# EAGLE schematic Roland+mem2 (EAGLE 6.6.0)

## Sheet 1 of 4
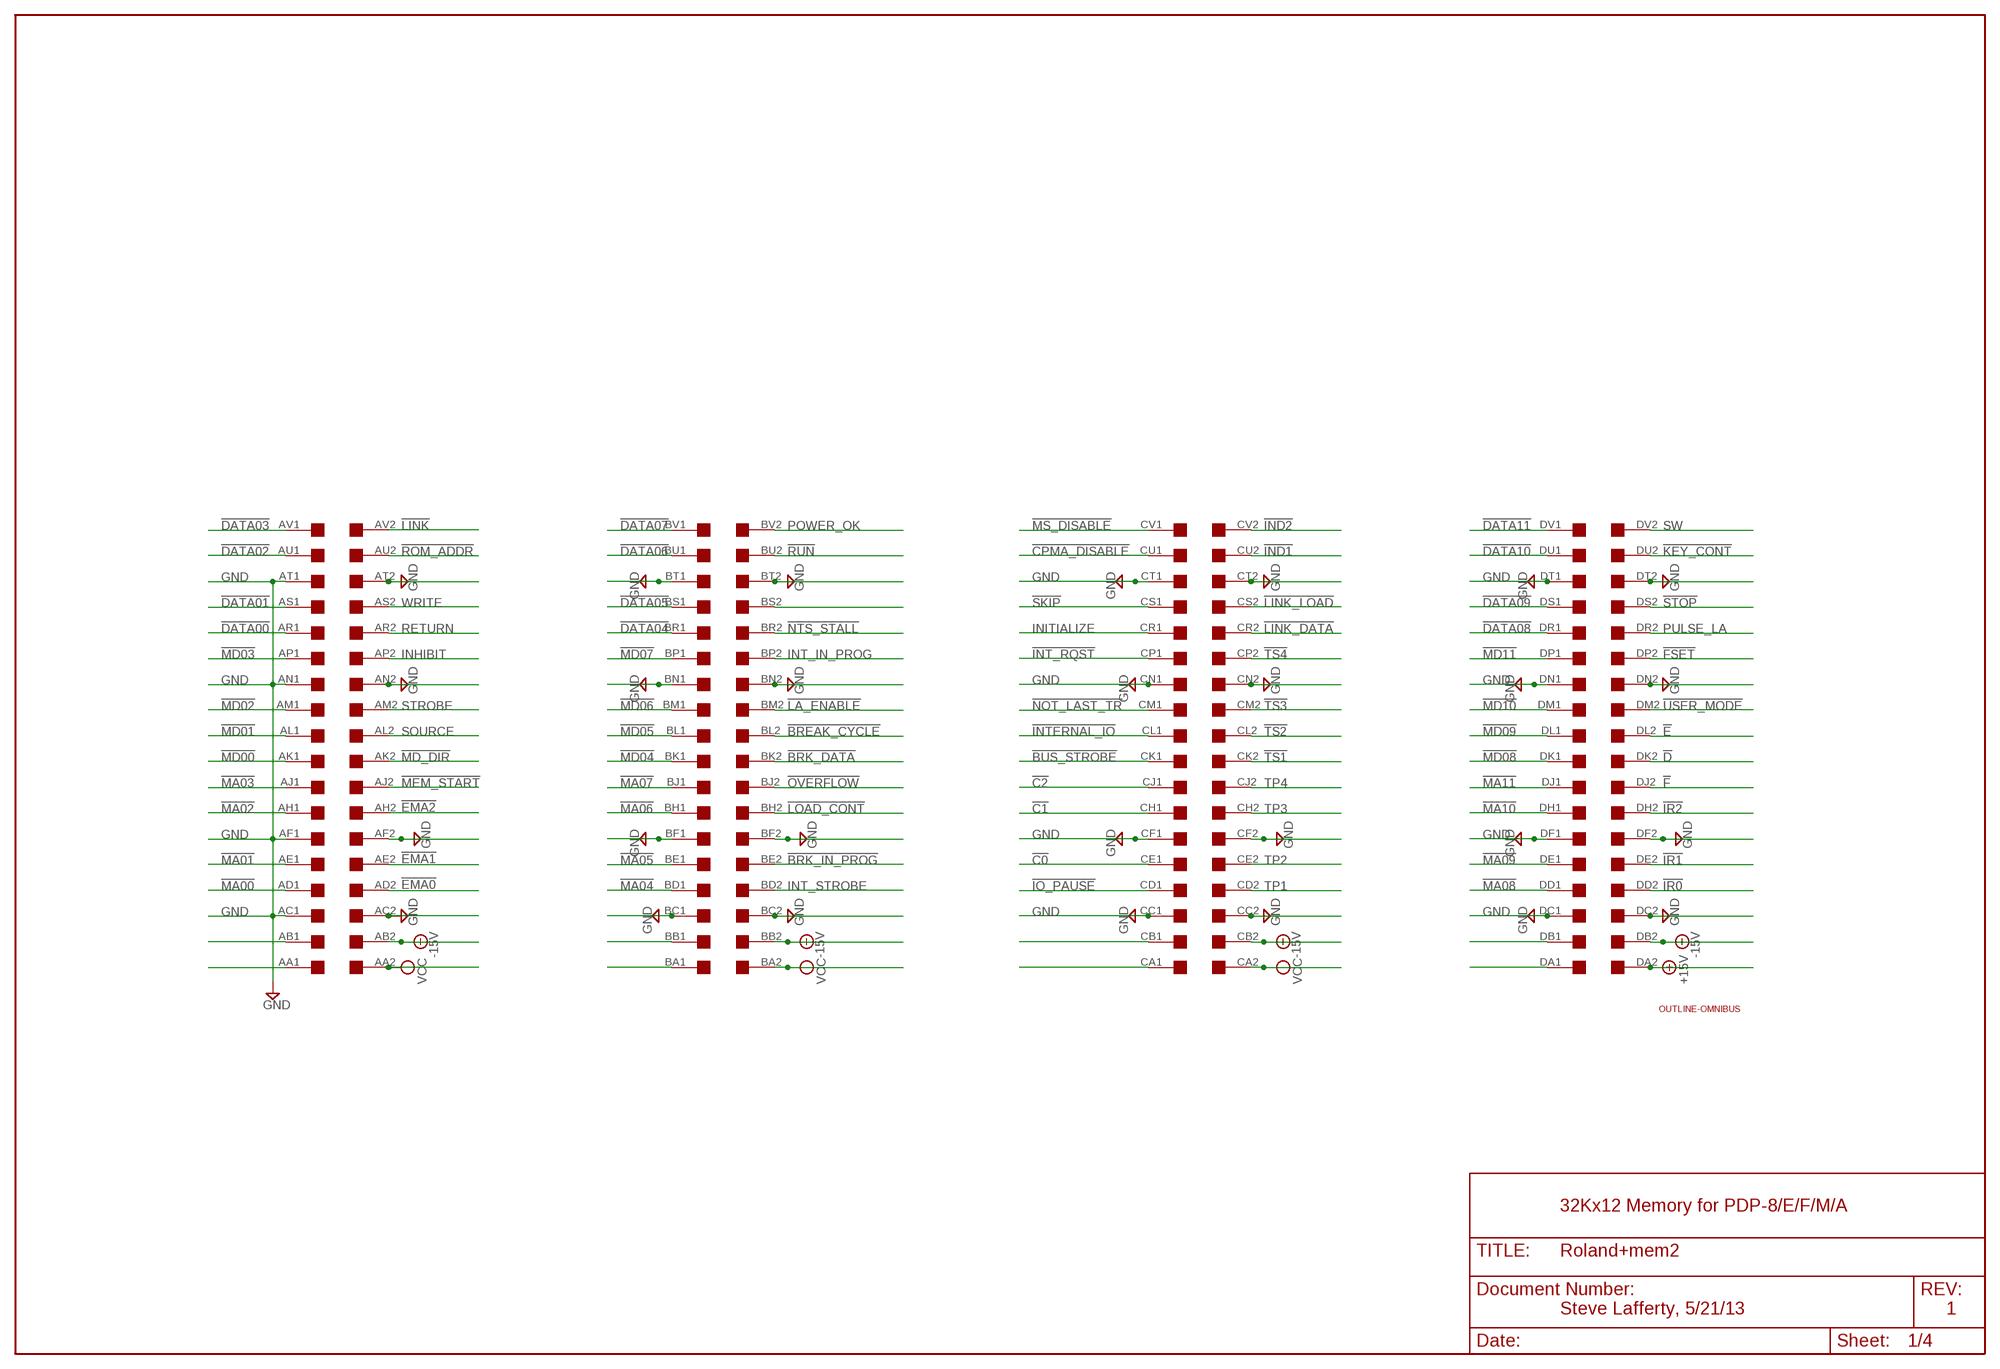
[diagram p0: schematic, sheet 1]

### Parts
J1  EDGE  QUAD  [EDGE-CON8]
U$1  OUTLINE-OMNIBUS  [OMNIBUS]

### Nets
!BREAK_CYCLE: J1.BL2
!BRK_DATA: J1.BK2 ; also sheet 2
!BRK_IN_PROG: J1.BE2
!BUS_STROBE: J1.CK1
!C0: J1.CE1
!C1: J1.CH1
!C2: J1.CJ1
!CPMA_DISABLE: J1.CU1
!D: J1.DK2
!DATA00: J1.AR1 ; also sheet 2
!DATA01: J1.AS1 ; also sheet 2
!DATA02: J1.AU1 ; also sheet 2
!DATA03: J1.AV1 ; also sheet 2
!DATA04: J1.BR1 ; also sheet 2
!DATA05: J1.BS1 ; also sheet 2
!DATA06: J1.BU1 ; also sheet 2
!DATA07: J1.BV1 ; also sheet 2
!DATA08: J1.DR1 ; also sheet 2
!DATA09: J1.DS1 ; also sheet 2
!DATA10: J1.DU1 ; also sheet 2
!DATA11: J1.DV1 ; also sheet 2
!E: J1.DL2
!EMA0: J1.AD2 ; also sheet 3
!EMA1: J1.AE2 ; also sheet 3
!EMA2: J1.AH2 ; also sheet 3
!F: J1.DJ2
!FSET: J1.DP2
!IND1: J1.CU2
!IND2: J1.CV2
!INT_RQST: J1.CP1
!INTERNAL_IO: J1.CL1
!IO_PAUSE: J1.CD1
!IR0: J1.DD2
!IR1: J1.DE2
!IR2: J1.DH2
!KEY_CONT: J1.DU2 ; also sheet 2
!LA_ENABLE: J1.BM2 ; also sheet 2
!LINK: J1.AV2
!LINK_DATA: J1.CR2
!LINK_LOAD: J1.CS2
!LOAD_CONT: J1.BH2
!MA00: J1.AD1 ; also sheet 3
!MA01: J1.AE1 ; also sheet 3
!MA02: J1.AH1 ; also sheet 3
!MA03: J1.AJ1 ; also sheet 3
!MA04: J1.BD1 ; also sheet 3
!MA05: J1.BE1 ; also sheet 3
!MA06: J1.BH1 ; also sheet 3
!MA07: J1.BJ1 ; also sheet 3
!MA08: J1.DD1 ; also sheet 3
!MA09: J1.DE1 ; also sheet 3
!MA10: J1.DH1 ; also sheet 3
!MA11: J1.DJ1 ; also sheet 3
!MD00: J1.AK1 ; also sheet 3
!MD01: J1.AL1 ; also sheet 3
!MD02: J1.AM1 ; also sheet 3
!MD03: J1.AP1 ; also sheet 3
!MD04: J1.BK1 ; also sheet 3
!MD05: J1.BL1 ; also sheet 3
!MD06: J1.BM1 ; also sheet 3
!MD07: J1.BP1 ; also sheet 3
!MD08: J1.DK1 ; also sheet 3
!MD09: J1.DL1 ; also sheet 3
!MD10: J1.DM1 ; also sheet 3
!MD11: J1.DP1 ; also sheet 3
!MD_DIR: J1.AK2 ; also sheet 2,3
!MEM_START: J1.AJ2 ; also sheet 2
!MS_DISABLE: J1.CV1 ; also sheet 2
!NOT_LAST_TR: J1.CM1
!NTS_STALL: J1.BR2
!OVERFLOW: J1.BJ2
!ROM_ADDR: J1.AU2 ; also sheet 3
!RUN: J1.BU2 ; also sheet 2
!SKIP: J1.CS1
!STOP: J1.DS2 ; also sheet 2
!TS1: J1.CK2
!TS2: J1.CL2
!TS3: J1.CM2
!TS4: J1.CP2 ; also sheet 2
!USER_MODE: J1.DM2
+15V: J1.DA2
-15V [supply]: J1.AB2 J1.BB2 J1.CB2 J1.DB2
GND [supply]: J1.AC1 J1.AC2 J1.AF1 J1.AF2 J1.AN1 J1.AN2 J1.AT1 J1.AT2 J1.BC1 J1.BC2 J1.BF1 J1.BF2 J1.BN1 J1.BN2 J1.BT1 J1.BT2 J1.CC1 J1.CC2 J1.CF1 J1.CF2 J1.CN1 J1.CN2 J1.CT1 J1.CT2 J1.DC1 J1.DC2 J1.DF1 J1.DF2 J1.DN1 J1.DN2 J1.DT1 J1.DT2 ; also sheet 2,3,4
INHIBIT: J1.AP2
INITIALIZE: J1.CR1 ; also sheet 2
INT_IN_PROG: J1.BP2
INT_STROBE: J1.BD2
N$46: J1.AB1
N$47: J1.AA1
N$48: J1.BB1
N$49: J1.BA1
N$50: J1.CA1
N$51: J1.BS2
N$52: J1.CB1
N$53: J1.DA1
N$54: J1.DB1
POWER_OK: J1.BV2 ; also sheet 3
PULSE_LA: J1.DR2 ; also sheet 2
RETURN: J1.AR2
SOURCE: J1.AL2 ; also sheet 3
STROBE: J1.AM2
SW: J1.DV2 ; also sheet 2
TP1: J1.CD2
TP2: J1.CE2
TP3: J1.CH2
TP4: J1.CJ2 ; also sheet 2
VCC [supply]: J1.AA2 J1.BA2 J1.CA2 ; also sheet 2,3
WRITE: J1.AS2 ; also sheet 3

### Notes on the sheet
- 32Kx12 Memory for PDP-8/E/F/M/A
- Steve Lafferty, 5/21/13 | 1

## Sheet 2 of 4
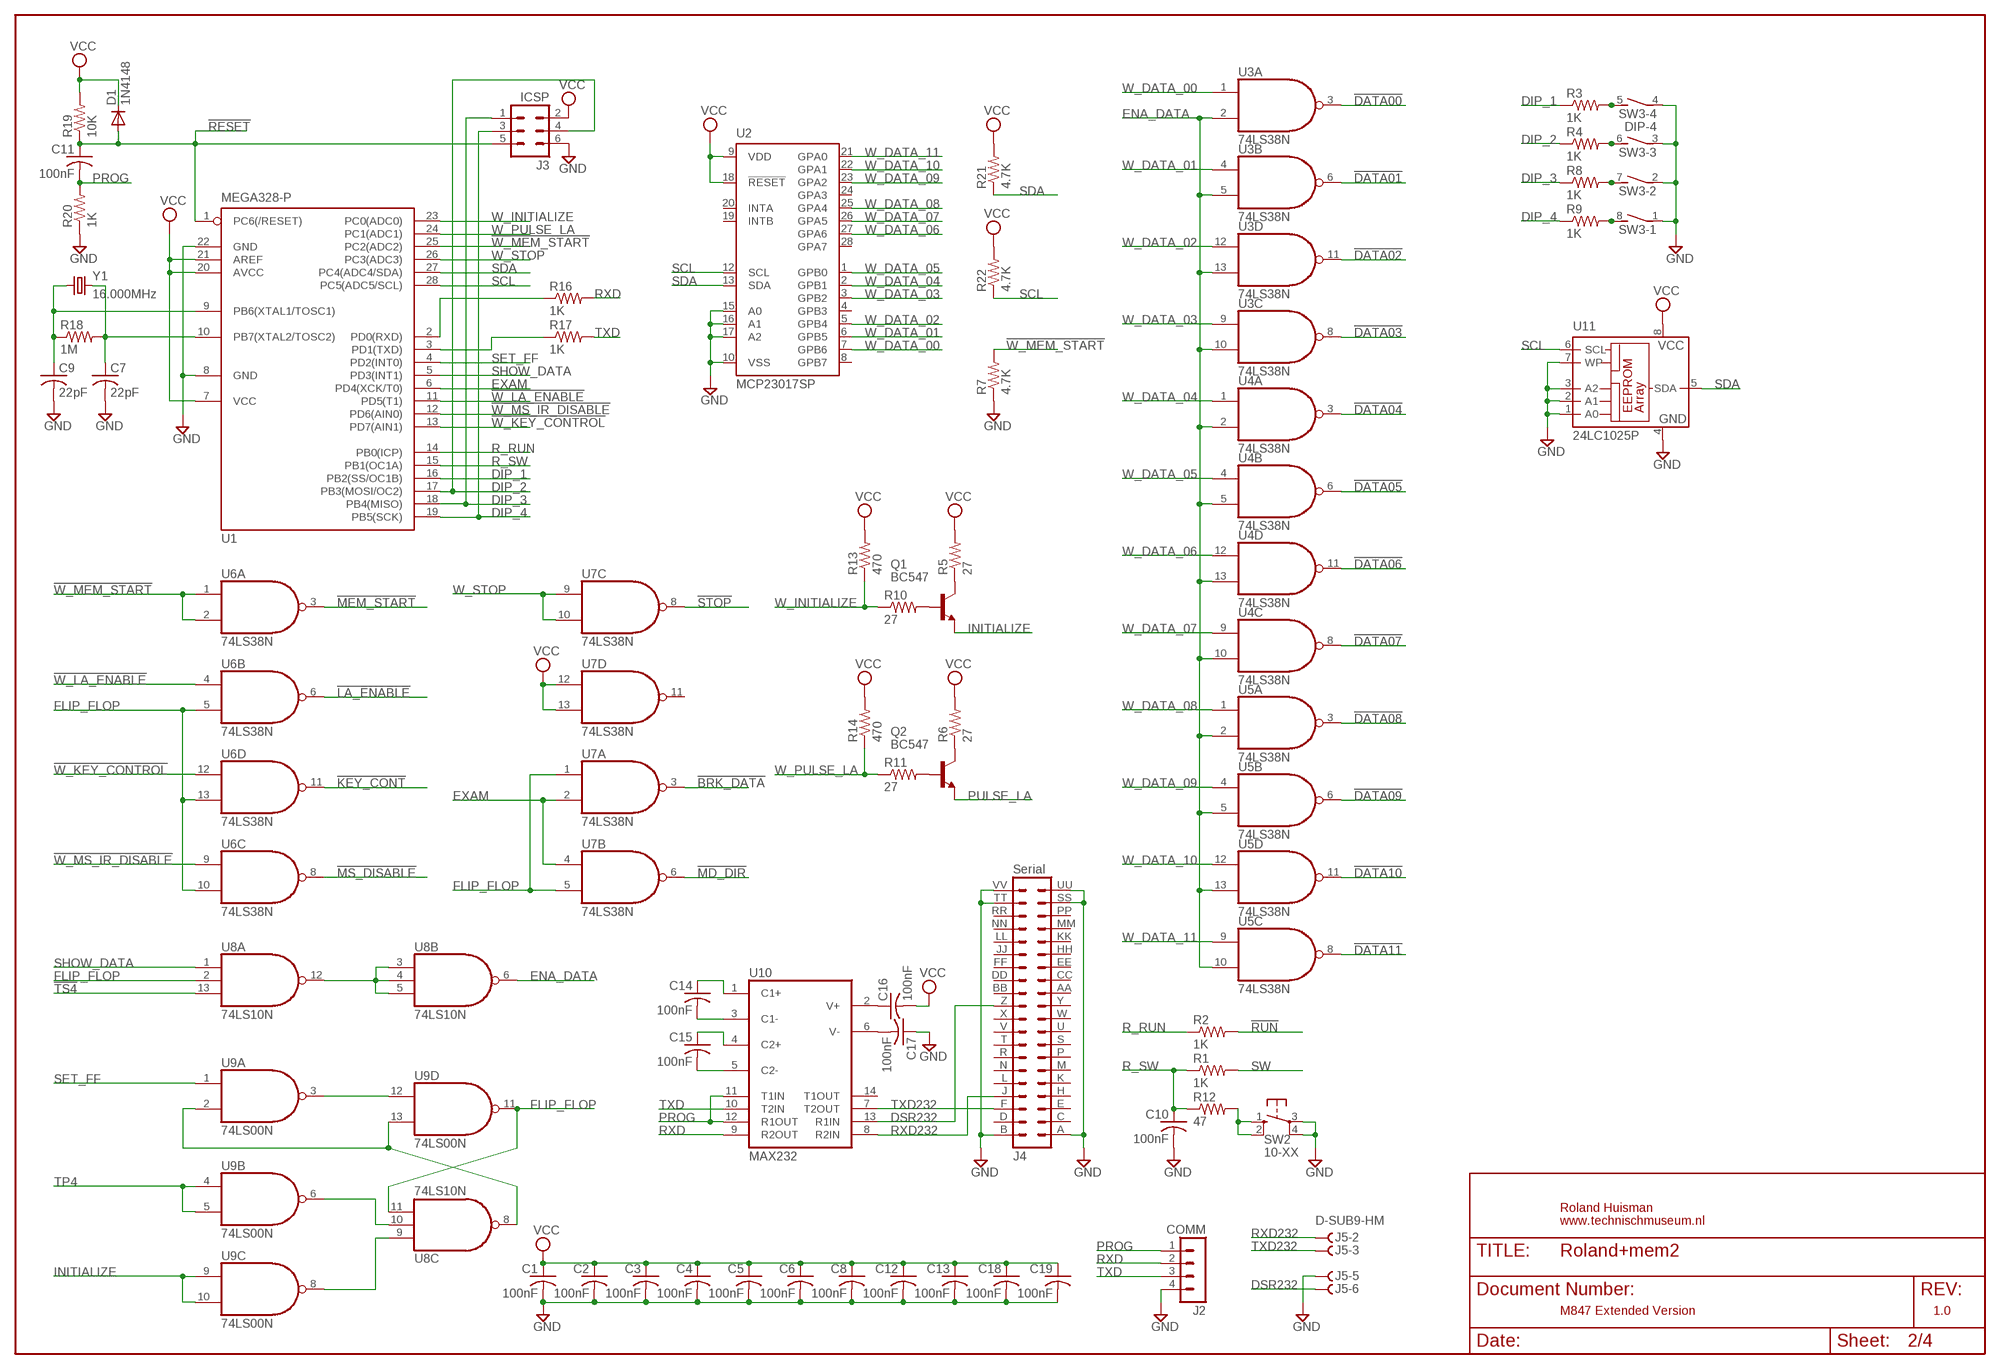
[diagram p1: schematic, sheet 2]

### Parts
C1  100nF  C-US050-025X075  [C050-025X075]
C2  100nF  C-US050-025X075  [C050-025X075]
C3  100nF  C-US050-025X075  [C050-025X075]
C4  100nF  C-US050-025X075  [C050-025X075]
C5  100nF  C-US050-025X075  [C050-025X075]
C6  100nF  C-US050-025X075  [C050-025X075]
C7  22pF  C-US050-025X075  [C050-025X075]
C8  100nF  C-US050-025X075  [C050-025X075]
C9  22pF  C-US050-025X075  [C050-025X075]
C10  100nF  C-US050-025X075  [C050-025X075]
C11  100nF  C-US050-025X075  [C050-025X075]
C12  100nF  C-US050-025X075  [C050-025X075]
C13  100nF  C-US050-025X075  [C050-025X075]
C14  100nF  C-US050-025X075  [C050-025X075]
C15  100nF  C-US050-025X075  [C050-025X075]
C16  100nF  C-US050-025X075  [C050-025X075]
C17  100nF  C-US050-025X075  [C050-025X075]
C18  100nF  C-US050-025X075  [C050-025X075]
C19  100nF  C-US050-025X075  [C050-025X075]
D1  1N4148  1N4148DO35-10  [DO35-10]
J2  COMM  MA04-1  [MA04-1]
J3  ICSP  MA03-2  [MA03-2]
J4  Serial  DEC40PINH  [DEC40PINH]
J5  D-SUB9-HM  D-SUB9-H5M09RA  [H5M09RA]
Q1  BC547  -NPN-TO5  [TO5]
Q2  BC547  -NPN-TO5  [TO5]
R1  1K  R-US_0207/10  [0207/10]
R2  1K  R-US_0207/10  [0207/10]
R3  1K  R-US_0207/10  [0207/10]
R4  1K  R-US_0207/10  [0207/10]
R5  27  R-US_0207/10  [0207/10]
R6  27  R-US_0207/10  [0207/10]
R7  4.7K  R-US_0207/10  [0207/10]
R8  1K  R-US_0207/10  [0207/10]
R9  1K  R-US_0207/10  [0207/10]
R10  27  R-US_0207/10  [0207/10]
R11  27  R-US_0207/10  [0207/10]
R12  47  R-US_0207/10  [0207/10]
R13  470  R-US_0207/10  [0207/10]
R14  470  R-US_0207/10  [0207/10]
R16  1K  R-US_0207/10  [0207/10]
R17  1K  R-US_0207/10  [0207/10]
R18  1M  R-US_0207/10  [0207/10]
R19  10K  R-US_0207/10  [0207/10]
R20  1K  R-US_0207/10  [0207/10]
R21  4.7K  R-US_0207/10  [0207/10]
R22  4.7K  R-US_0207/10  [0207/10]
SW2  10-XX  [B3F-10XX]
SW3  DIP-4  DIP04S  [DIP04S]
U1  MEGA328-P  MEGA8-P  [DIL28-3]
U2  MCP23017SP  [DIL28-3]
U3  74LS38N  [DIL14]
U4  74LS38N  [DIL14]
U5  74LS38N  [DIL14]
U6  74LS38N  [DIL14]
U7  74LS38N  [DIL14]
U8  74LS10N  [DIL14]
U9  74LS00N  [DIL14]
U10  MAX232  [DIL16]
U11  24LC1025P  24LC025P  [DIL8]
Y1  16.000MHz  CRYSTALHC49U-H  [HC49U-H]

### Nets
!BRK_DATA: U7.3(A:O) ; also sheet 1
!DATA00: U3.3(A:O) ; also sheet 1
!DATA01: U3.6(B:O) ; also sheet 1
!DATA02: U3.11(D:O) ; also sheet 1
!DATA03: U3.8(C:O) ; also sheet 1
!DATA04: U4.3(A:O) ; also sheet 1
!DATA05: U4.6(B:O) ; also sheet 1
!DATA06: U4.11(D:O) ; also sheet 1
!DATA07: U4.8(C:O) ; also sheet 1
!DATA08: U5.3(A:O) ; also sheet 1
!DATA09: U5.6(B:O) ; also sheet 1
!DATA10: U5.11(D:O) ; also sheet 1
!DATA11: U5.8(C:O) ; also sheet 1
!KEY_CONT: U6.11(D:O) ; also sheet 1
!LA_ENABLE: U6.6(B:O) ; also sheet 1
!MD_DIR: U7.6(B:O) ; also sheet 1,3
!MEM_START: U6.3(A:O) ; also sheet 1
!MS_DISABLE: U6.8(C:O) ; also sheet 1
!RESET: C11.1 D1.A J3.5 R19.1 U1.1(PC6(/RESET))
!RUN: R2.2 ; also sheet 1
!STOP: U7.8(C:O) ; also sheet 1
!TS4: U8.13(A:I2) ; also sheet 1
!W_KEY_CONTROL: U1.13(PD7(AIN1)) U6.12(D:I0)
!W_LA_ENABLE: U1.11(PD5(T1)) U6.4(B:I0)
!W_MEM_START: R7.2 U1.25(PC2(ADC2)) U6.1(A:I0) U6.2(A:I1)
!W_MS_IR_DISABLE: U1.12(PD6(AIN0)) U6.9(C:I0)
DIP_1: R3.1 U1.16(PB2(SS/OC1B))
DIP_2: J3.4 R4.1 U1.17(PB3(MOSI/OC2))
DIP_3: J3.1 R8.1 U1.18(PB4(MISO))
DIP_4: J3.3 R9.1 U1.19(PB5(SCK))
DSR232: J4.Z J5.6 U10.13(R1IN)
ENA_DATA: U3.2(A:I1) U3.5(B:I1) U3.10(C:I1) U3.13(D:I1) U4.2(A:I1) U4.5(B:I1) U4.10(C:I1) U4.13(D:I1) U5.2(A:I1) U5.5(B:I1) U5.10(C:I1) U5.13(D:I1) U8.6(B:O)
EXAM: U1.6(PD4(XCK/T0)) U7.2(A:I1) U7.4(B:I0)
FLIP_FLOP: U6.5(B:I1) U6.10(C:I1) U6.13(D:I1) U7.1(A:I0) U7.5(B:I1) U8.2(A:I1) U8.11(C:I2) U9.11(D:O)
GND [supply]: C1.2 C2.2 C3.2 C4.2 C5.2 C6.2 C7.2 C8.2 C9.2 C10.2 C12.2 C13.2 C17.1 C18.2 C19.2 J2.4 J3.6 J4.A J4.B J4.SS J4.TT J4.UU J4.VV J5.5 R7.1 R20.1 SW2.3(P) SW2.4(P1) SW3.1 SW3.2 SW3.3 SW3.4 U1.8(GND) U1.22(GND) U2.10(VSS) U2.15(A0) U2.16(A1) U2.17(A2) U11.1(A0) U11.2(A1) U11.3(A2) U11.4(GND) U11.7(WP) ; also sheet 1,3,4
INITIALIZE: Q1.1(E) U9.9(C:I0) U9.10(C:I1) ; also sheet 1
N$1: C7.1 R18.2 U1.10(PB7(XTAL2/TOSC2)) Y1.1
N$2: C9.1 R18.1 U1.9(PB6(XTAL1/TOSC1)) Y1.2
N$4: Q1.3(C) R5.1
N$5: Q1.2(B) R10.2
N$6: Q2.3(C) R6.1
N$7: Q2.2(B) R11.2
N$8: U9.3(A:O) U9.12(D:I0)
N$9: U8.3(B:I0) U8.4(B:I1) U8.5(B:I2) U8.12(A:O)
N$10: U8.8(C:O) U9.2(A:I1) U9.13(D:I1)
N$12: R17.1 U1.3(PD1(TXD))
N$13: R16.1 U1.2(PD0(RXD))
N$14: U8.10(C:I1) U9.6(B:O)
N$15: U8.9(C:I0) U9.8(C:O)
N$16: C17.2 U10.6(V-)
N$17: C14.1 U10.1(C1+)
N$827: C14.2 U10.3(C1-)
N$914: C15.2 U10.5(C2-)
N$915: C15.1 U10.4(C2+)
N$916: C16.1 U10.2(V+)
N$918: R12.2 SW2.1(S) SW2.2(S1)
N$919: R3.2 SW3.5
N$920: R4.2 SW3.6
N$921: R8.2 SW3.7
N$922: R9.2 SW3.8
PROG: C11.2 J2.1 R20.2 U10.11(T1IN) U10.12(R1OUT)
PULSE_LA: Q2.1(E) ; also sheet 1
R_RUN: R2.1 U1.14(PB0(ICP))
R_SW: C10.1 R1.1 R12.1 U1.15(PB1(OC1A))
RXD: J2.2 R16.2 U10.9(R2OUT)
RXD232: J4.J J5.2 U10.8(R2IN)
SCL: R22.1 U1.28(PC5(ADC5/SCL)) U2.12(SCL) U11.6(SCL)
SDA: R21.1 U1.27(PC4(ADC4/SDA)) U2.13(SDA) U11.5(SDA)
SET_FF: U1.4(PD2(INT0)) U9.1(A:I0)
SHOW_DATA: U1.5(PD3(INT1)) U8.1(A:I0)
SW: R1.2 ; also sheet 1
TP4: U9.4(B:I0) U9.5(B:I1) ; also sheet 1
TXD: J2.3 R17.2 U10.10(T2IN)
TXD232: J4.F J5.3 U10.7(T2OUT)
VCC [supply]: C1.1 C2.1 C3.1 C4.1 C5.1 C6.1 C8.1 C12.1 C13.1 C16.2 C18.1 C19.1 D1.C J3.2 R5.2 R6.2 R13.2 R14.2 R19.2 R21.2 R22.2 U1.7(VCC) U1.20(AVCC) U1.21(AREF) U2.9(VDD) U2.18(!RESET) U7.12(D:I0) U7.13(D:I1) U11.8(VCC) ; also sheet 1,3
W_DATA_00: U2.7(GPB6) U3.1(A:I0)
W_DATA_01: U2.6(GPB5) U3.4(B:I0)
W_DATA_02: U2.5(GPB4) U3.12(D:I0)
W_DATA_03: U2.3(GPB2) U3.9(C:I0)
W_DATA_04: U2.2(GPB1) U4.1(A:I0)
W_DATA_05: U2.1(GPB0) U4.4(B:I0)
W_DATA_06: U2.27(GPA6) U4.12(D:I0)
W_DATA_07: U2.26(GPA5) U4.9(C:I0)
W_DATA_08: U2.25(GPA4) U5.1(A:I0)
W_DATA_09: U2.23(GPA2) U5.4(B:I0)
W_DATA_10: U2.22(GPA1) U5.12(D:I0)
W_DATA_11: U2.21(GPA0) U5.9(C:I0)
W_INITIALIZE: R10.1 R13.1 U1.23(PC0(ADC0))
W_PULSE_LA: R11.1 R14.1 U1.24(PC1(ADC1))
W_STOP: U1.26(PC3(ADC3)) U7.9(C:I0) U7.10(C:I1)
Unconnected: J4.AA J4.BB J4.C J4.CC J4.D J4.DD J4.E J4.EE J4.FF J4.H J4.HH J4.JJ J4.K J4.KK J4.L J4.LL J4.M J4.MM J4.N J4.NN J4.P J4.PP J4.R J4.RR J4.S J4.T J4.U J4.V J4.W J4.X J4.Y J5.1 J5.4 J5.7 J5.8 J5.9 U2.4(GPB3) U2.8(GPB7) U2.19(INTB) U2.20(INTA) U2.24(GPA3) U2.28(GPA7) U7.11(D:O) U10.14(T1OUT)

### Notes on the sheet
- Roland Huisman
- D-SUB9-HM | www.technischmuseum.nl
- M847 Extended Version | 1.0

## Sheet 3 of 4
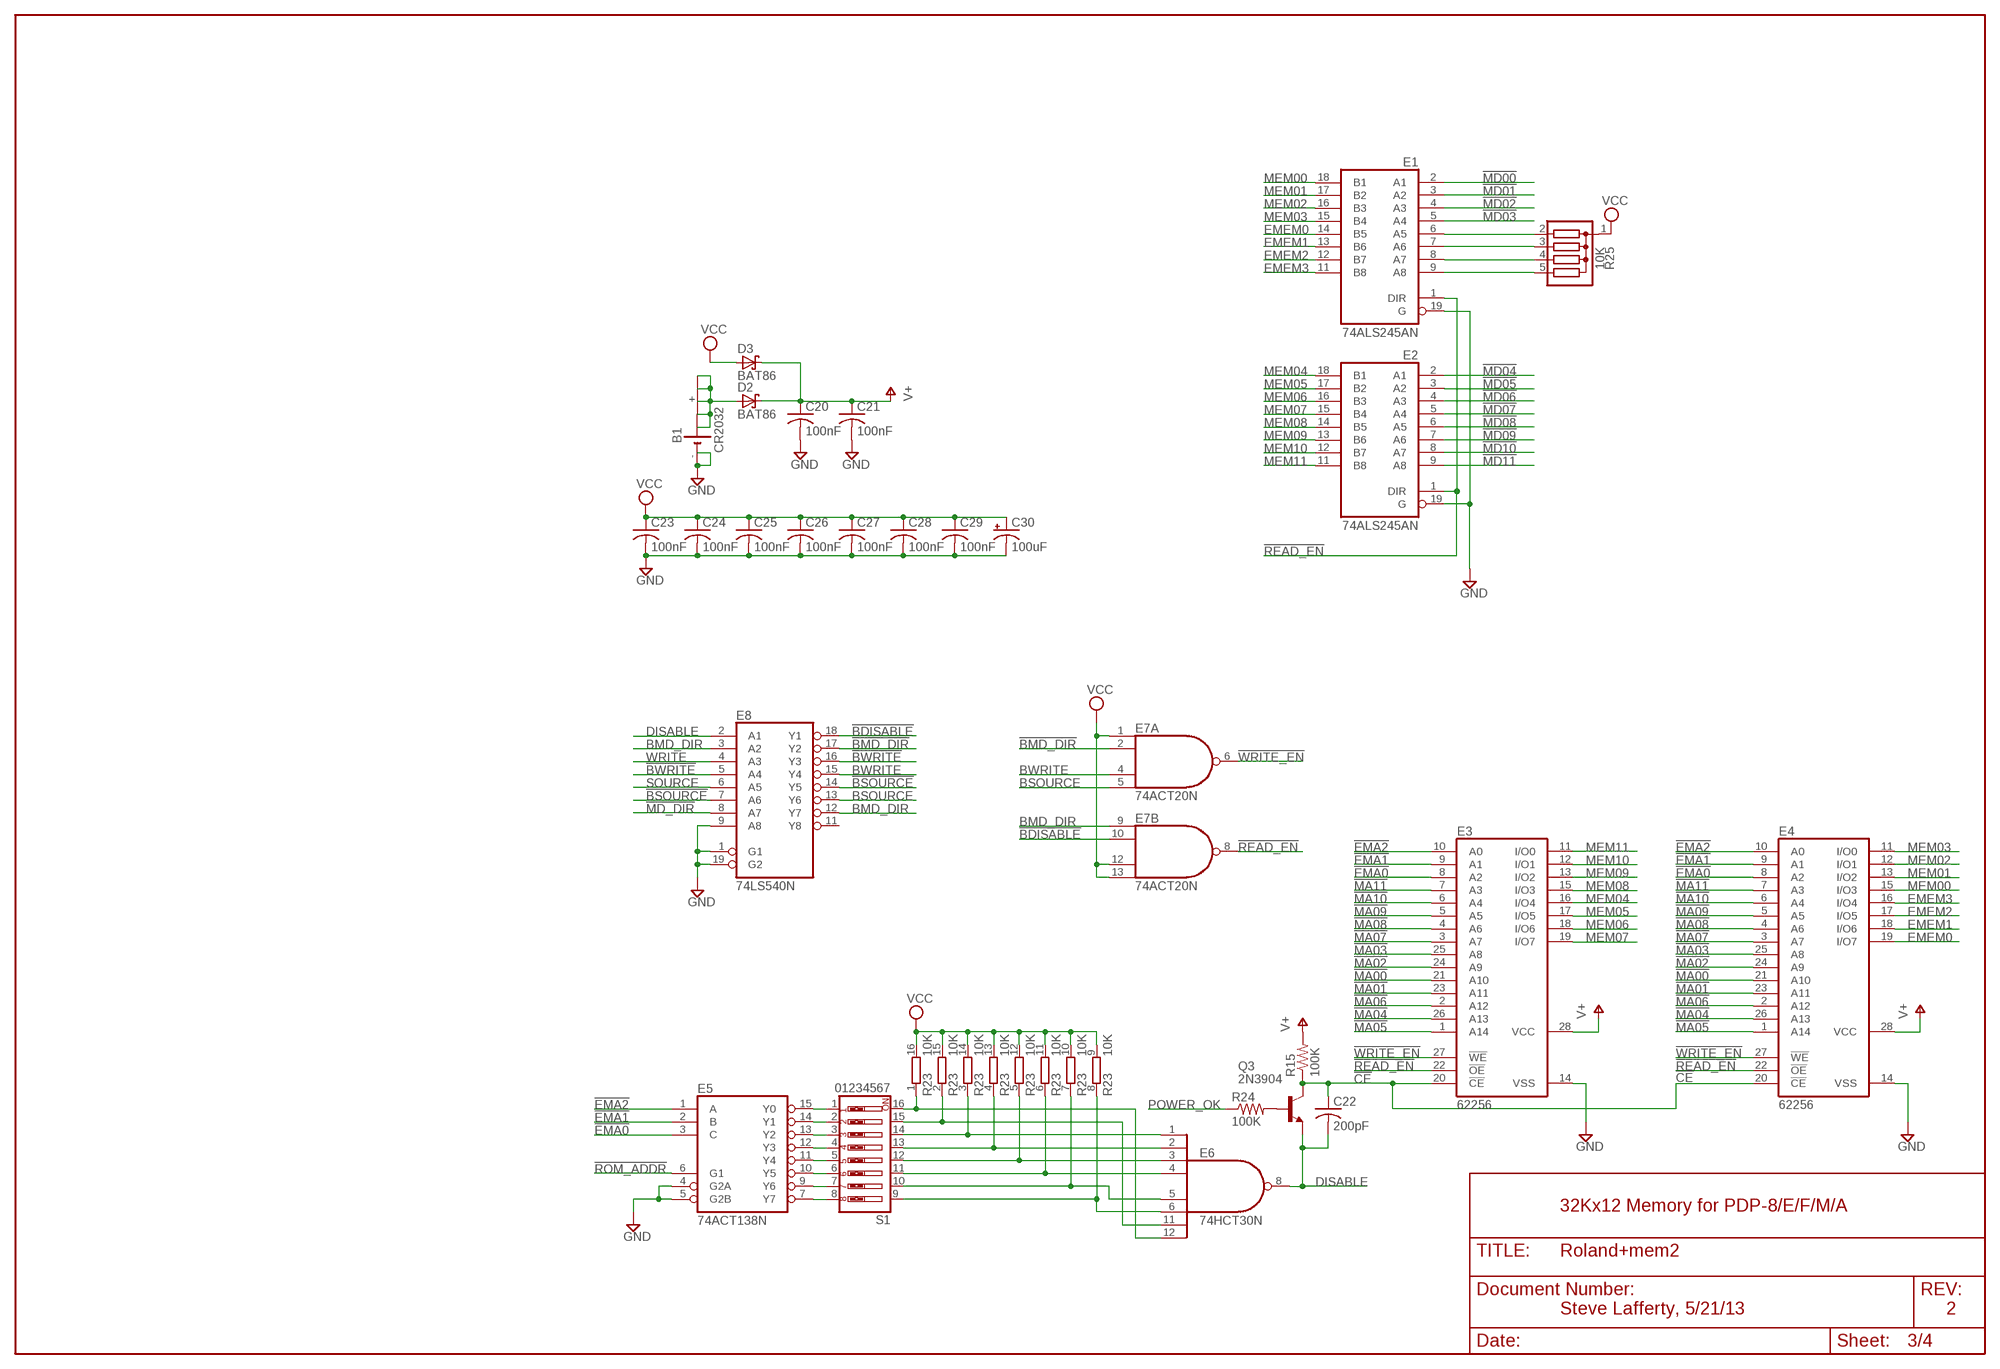
[diagram p2: schematic, sheet 3]

### Parts
B1  CR2032  B2430UNI  [B2430UNI]
C20  100nF  C-US050-025X075  [C050-025X075]
C21  100nF  C-US050-025X075  [C050-025X075]
C22  200pF  C-US050-025X075  [C050-025X075]
C23  100nF  C-US050-025X075  [C050-025X075]
C24  100nF  C-US050-025X075  [C050-025X075]
C25  100nF  C-US050-025X075  [C050-025X075]
C26  100nF  C-US050-025X075  [C050-025X075]
C27  100nF  C-US050-025X075  [C050-025X075]
C28  100nF  C-US050-025X075  [C050-025X075]
C29  100nF  C-US050-025X075  [C050-025X075]
C30  100uF  CPOL-USE20-8AXIAL  [E12-8]
D2  BAT86  BAT19  [DO35-10]
D3  BAT86  BAT19  [DO35-10]
E1  74ALS245AN  74LS245N  [DIL20]
E2  74ALS245AN  74LS245N  [DIL20]
E3  62256  58C256P  [DIL28-6]
E4  62256  58C256P  [DIL28-6]
E5  74ACT138N  74LS138N  [DIL16]
E6  74HCT30N  74LS30N  [DIL14]
E7  74ACT20N  74LS20N  [DIL14]
E8  74LS540N  [DIL20]
Q3  2N3904  [TO92]
R15  100K  R-US_0207/10  [0207/10]
R23  10K  8R-P  [DIL16]
R24  100K  R-US_0207/10  [0207/10]
R25  10K  G04R  [SIL5]
S1  01234567  SW_DIP-8  [EDG-08]

### Nets
!BDISABLE: E7.10(B:I1) E8.18(Y1)
!BMD_DIR: E7.2(A:I1) E8.17(Y2)
!BSOURCE: E8.7(A6) E8.14(Y5)
!BWRITE: E8.5(A4) E8.16(Y3)
!CE: C22.1 E3.20(!CE) E4.20(!CE) Q3.1(C) R15.1
!EMA0: E3.8(A2) E4.8(A2) E5.3(C) ; also sheet 1
!EMA1: E3.9(A1) E4.9(A1) E5.2(B) ; also sheet 1
!EMA2: E3.10(A0) E4.10(A0) E5.1(A) ; also sheet 1
!MA00: E3.21(A10) E4.21(A10) ; also sheet 1
!MA01: E3.23(A11) E4.23(A11) ; also sheet 1
!MA02: E3.24(A9) E4.24(A9) ; also sheet 1
!MA03: E3.25(A8) E4.25(A8) ; also sheet 1
!MA04: E3.26(A13) E4.26(A13) ; also sheet 1
!MA05: E3.1(A14) E4.1(A14) ; also sheet 1
!MA06: E3.2(A12) E4.2(A12) ; also sheet 1
!MA07: E3.3(A7) E4.3(A7) ; also sheet 1
!MA08: E3.4(A6) E4.4(A6) ; also sheet 1
!MA09: E3.5(A5) E4.5(A5) ; also sheet 1
!MA10: E3.6(A4) E4.6(A4) ; also sheet 1
!MA11: E3.7(A3) E4.7(A3) ; also sheet 1
!MD00: E1.2(A1) ; also sheet 1
!MD01: E1.3(A2) ; also sheet 1
!MD02: E1.4(A3) ; also sheet 1
!MD03: E1.5(A4) ; also sheet 1
!MD04: E2.2(A1) ; also sheet 1
!MD05: E2.3(A2) ; also sheet 1
!MD06: E2.4(A3) ; also sheet 1
!MD07: E2.5(A4) ; also sheet 1
!MD08: E2.6(A5) ; also sheet 1
!MD09: E2.7(A6) ; also sheet 1
!MD10: E2.8(A7) ; also sheet 1
!MD11: E2.9(A8) ; also sheet 1
!MD_DIR: E8.8(A7) ; also sheet 1,2
!READ_EN: E1.1(DIR) E2.1(DIR) E3.22(!OE) E4.22(!OE) E7.8(B:O)
!ROM_ADDR: E5.6(G1) ; also sheet 1
!WRITE_EN: E3.27(!WE) E4.27(!WE) E7.6(A:O)
BMD_DIR: E7.9(B:I0) E8.3(A2) E8.12(Y7)
BSOURCE: E7.5(A:I3) E8.13(Y6)
BWRITE: E7.4(A:I2) E8.15(Y4)
DISABLE: C22.2 E6.8(O) E8.2(A1) Q3.3(E)
EMEM0: E1.14(B5) E4.19(I/O7)
EMEM1: E1.13(B6) E4.18(I/O6)
EMEM2: E1.12(B7) E4.17(I/O5)
EMEM3: E1.11(B8) E4.16(I/O4)
GND [supply]: B1.- B1.-@1(-) C20.2 C21.2 C23.2 C24.2 C25.2 C26.2 C27.2 C28.2 C29.2 C30.- E1.19(G) E2.19(G) E3.14(VSS) E4.14(VSS) E5.4(G2A) E5.5(G2B) E8.1(G1) E8.9(A8) E8.19(G2) ; also sheet 1,2,4
MEM00: E1.18(B1) E4.15(I/O3)
MEM01: E1.17(B2) E4.13(I/O2)
MEM02: E1.16(B3) E4.12(I/O1)
MEM03: E1.15(B4) E4.11(I/O0)
MEM04: E2.18(B1) E3.16(I/O4)
MEM05: E2.17(B2) E3.17(I/O5)
MEM06: E2.16(B3) E3.18(I/O6)
MEM07: E2.15(B4) E3.19(I/O7)
MEM08: E2.14(B5) E3.15(I/O3)
MEM09: E2.13(B6) E3.13(I/O2)
MEM10: E2.12(B7) E3.12(I/O1)
MEM11: E2.11(B8) E3.11(I/O0)
N$3: E5.7(Y7) S1.8
N$18: E5.9(Y6) S1.7
N$19: E5.10(Y5) S1.6
N$20: E5.11(Y4) S1.5
N$21: E5.12(Y3) S1.4
N$22: E5.13(Y2) S1.3
N$23: E5.14(Y1) S1.2
N$24: E5.15(Y0) S1.1
N$25: B1.+ B1.+@1(+) B1.+@2(+) B1.+@3(+) B1.+@4(+) D2.A
N$26: E6.2(I1) R23.4 S1.13
N$27: E6.1(I0) R23.3 S1.14
N$28: E6.3(I2) R23.5 S1.12
N$29: E6.4(I3) R23.6 S1.11
N$30: E6.5(I4) R23.7 S1.10
N$31: E6.6(I5) R23.8 S1.9
N$32: E6.12(I7) R23.1 S1.16
N$33: E6.11(I6) R23.2 S1.15
N$36: Q3.2(B) R24.2
N$39: E1.6(A5) R25.2
N$55: E1.9(A8) R25.5
N$56: E1.8(A7) R25.4
N$57: E1.7(A6) R25.3
POWER_OK: R24.1 ; also sheet 1
SOURCE: E8.6(A5) ; also sheet 1
V+: C20.1 C21.1 D2.C D3.C E3.28(VCC) E4.28(VCC) R15.2
VCC [supply]: C23.1 C24.1 C25.1 C26.1 C27.1 C28.1 C29.1 C30.+ D3.A E7.1(A:I0) E7.12(B:I2) E7.13(B:I3) R23.9 R23.10 R23.11 R23.12 R23.13 R23.14 R23.15 R23.16 R25.1 ; also sheet 1,2
WRITE: E8.4(A3) ; also sheet 1
Unconnected: E8.11(Y8)

### Notes on the sheet
- 32Kx12 Memory for PDP-8/E/F/M/A
- Steve Lafferty, 5/21/13 | 2

## Sheet 4 of 4
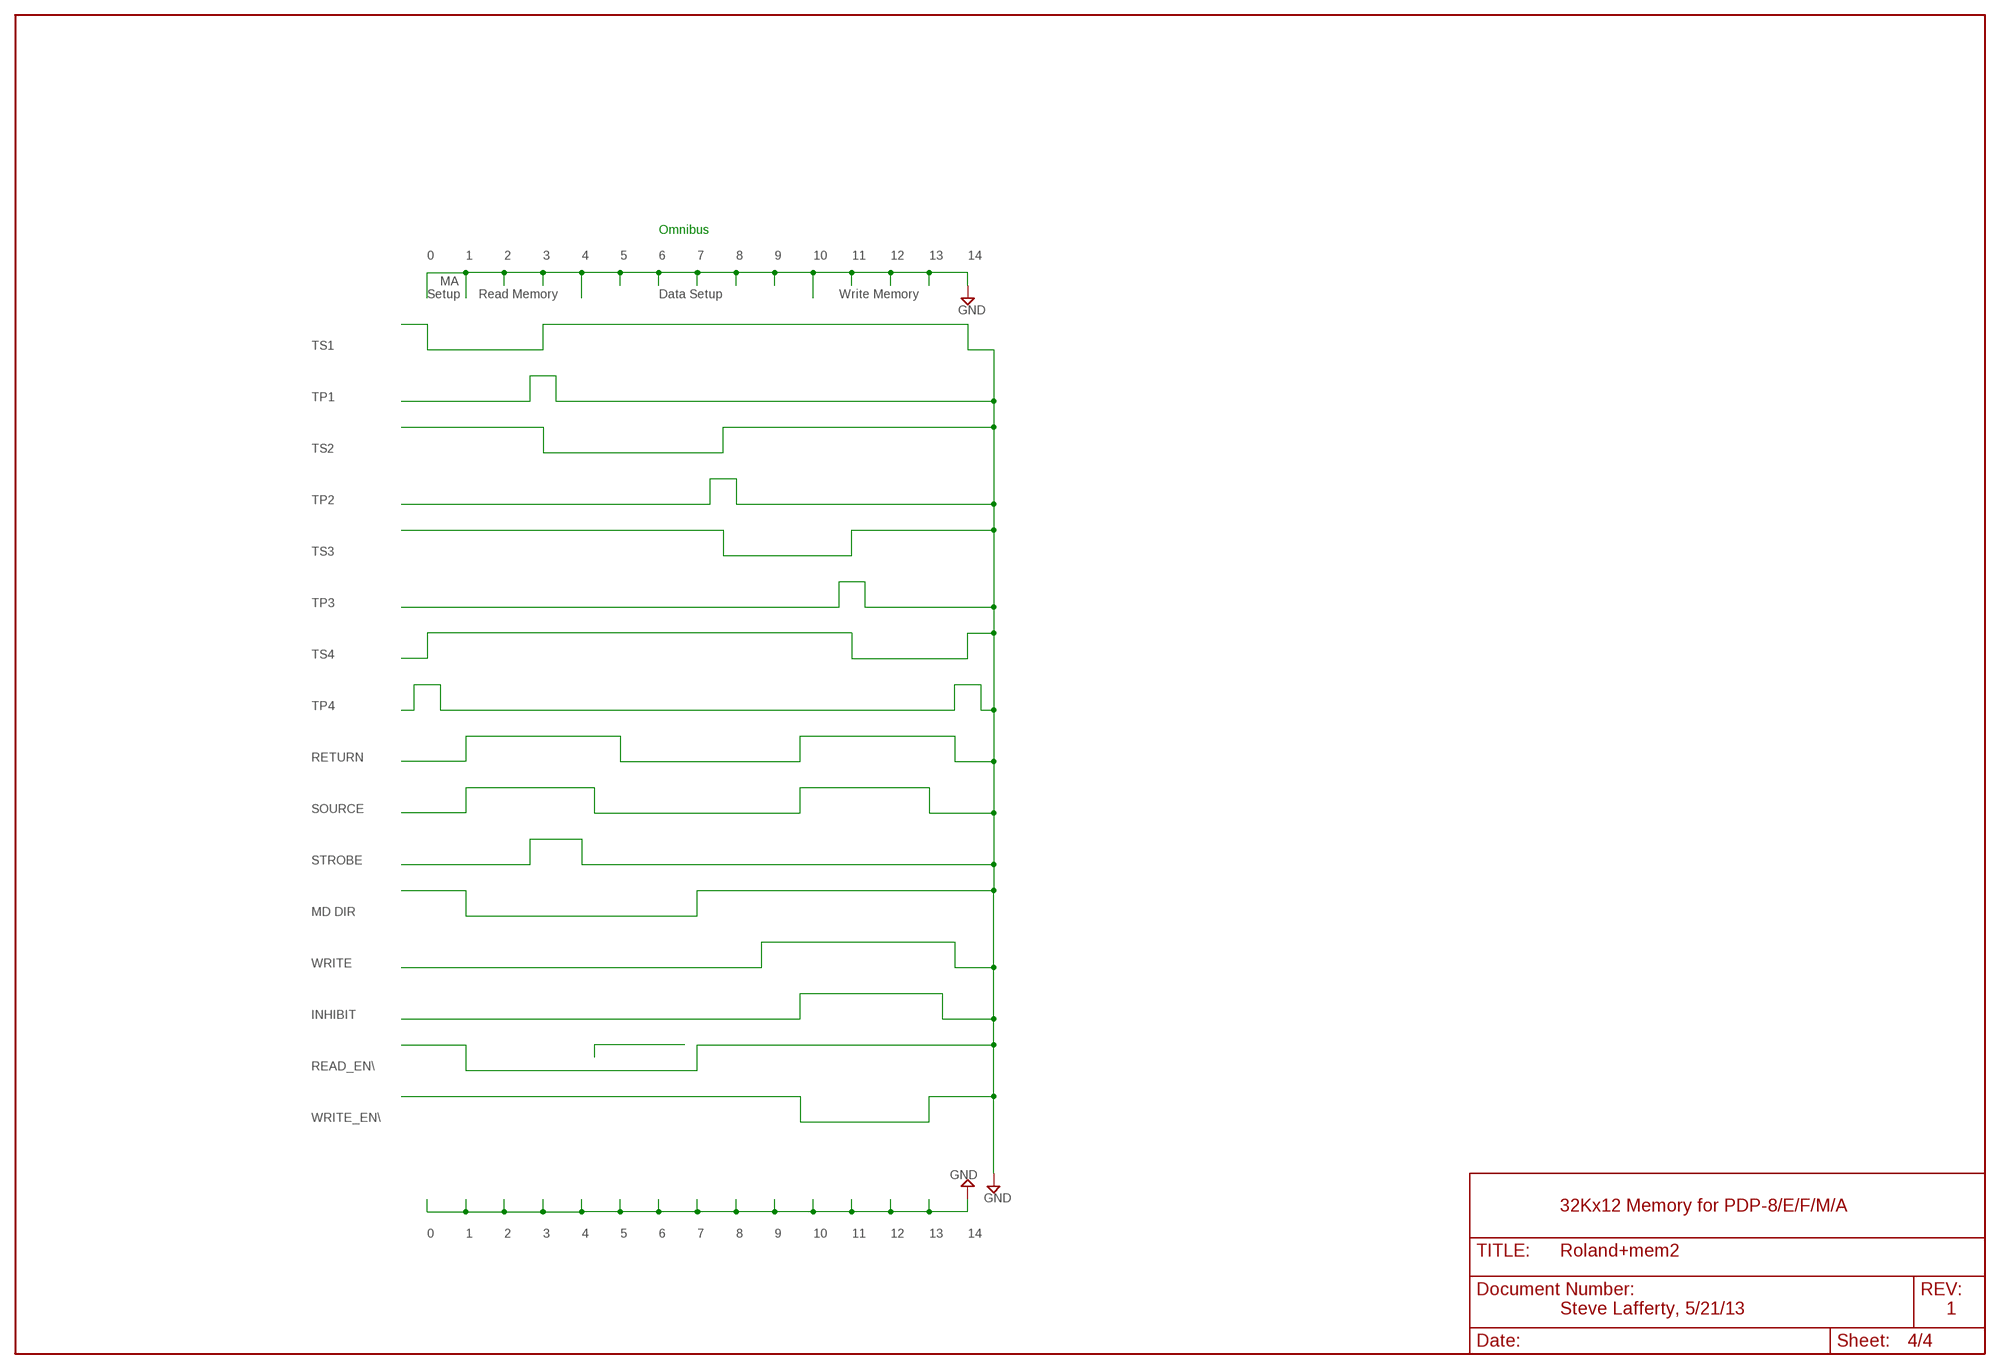
[diagram p3: schematic, sheet 4]

### Notes on the sheet
- Omnibus
- 0 | 1 | 2 | 3 | 4 | 5 | 6 | 7 | 8 | 9 | 10 | 11 | 12 | 13 | 14
- MA
- Setup | Read Memory | Data Setup | Write Memory
- TS1
- TP1
- TS2
- TP2
- TS3
- TP3
- TS4
- TP4
- RETURN
- SOURCE
- STROBE
- MD DIR
- WRITE
- INHIBIT
- READ_EN\\
- WRITE_EN\\
- 32Kx12 Memory for PDP-8/E/F/M/A
- 0 | 1 | 2 | 3 | 4 | 5 | 6 | 7 | 8 | 9 | 10 | 11 | 12 | 13 | 14
- Steve Lafferty, 5/21/13 | 1

## Power pins joined to a net without a drawn wire
GND: E1.10(GND) E2.10(GND) E5.8(GND) E6.7(GND) E7.7(P:GND) E8.10(GND) U3.7(P:GND) U4.7(P:GND) U5.7(P:GND) U6.7(P:GND) U7.7(P:GND) U8.7(P:GND) U9.7(P:GND) U10.15(GND)
VCC: E1.20(VCC) E2.20(VCC) E5.16(VCC) E6.14(VCC) E7.14(P:VCC) E8.20(VCC) U3.14(P:VCC) U4.14(P:VCC) U5.14(P:VCC) U6.14(P:VCC) U7.14(P:VCC) U8.14(P:VCC) U9.14(P:VCC) U10.16(VCC)

## Library data of the parts
B1 = battery:B2430UNI: LI BATTERY
C1-C29 = rcl:C-US: CAPACITOR, American symbol
C30 = dec-con:CPOL-USE20-8AXIAL: A 0.8 inch electrolytic.
D1 = diode:1N4148: DIODE high speed (Philips)
D2 D3 = diode:BAT19: DIODE barrier diode
E1 E2 = 74xx-us:74*245: Octal BUS TRANSCEIVER, 3-state
E3 E4 = memory-hitachi:58C256P: MEMORY
E5 = 74xx-us:74*138: 3-line to 8-line DECODER/DEMULTIPLEXER
E6 = 74xx-us:74*30: 8-input NAND gate
E7 = 74xx-us:74*20: Dual 4-input NAND gate
E8 = 74xx-us:74*540: Octal BUFFER and LINE DRIVER, 3-state
J1 = dec-con:QUAD: Quad-Height DEC board
J2 = con-lstb:MA04-1: PIN HEADER; OC_FARNELL: unknown; OC_NEWARK: unknown
J3 = con-lstb:MA03-2: PIN HEADER; OC_FARNELL: unknown; OC_NEWARK: unknown
J4 = dec-con:DEC40PIN: PIN HEADER
J5 = con-thomas-betts:D-SUB9-: D-Subminiatur Connector Source: Electronioc Interconnects European Edition 1998; OC_FARNELL: unknown; OC_NEWARK: unknown
Q1 Q2 = transistor:*-NPN-: NPN Transistror BF959 corrected 2008.03.06
Q3 = transistor:2N3904: NPN TRANSISTOR
R1-R22 R24 = rcl:R-US_: RESISTOR, American symbol
R23 = resistor-dil:8R-P: DIL RESISTOR
R25 = resistor-sil:G04R: SIL RESISTOR; OC_FARNELL: unknown; OC_NEWARK: unknown
S1 = special:SW_DIP-8: DIP SWITCH
SW2 = switch-omron:10-XX: OMRON SWITCH; MPN: B3F-1000; OC_FARNELL: 176432; OC_NEWARK: 36M3542
SW3 = switch-dil:DIP04S: DIL/CODE SWITCH; OC_FARNELL: unknown; OC_NEWARK: unknown
U1 = atmel:MEGA8-P: MICROCONTROLLER 8 Kbytes FLASH, 1 kbytes SRAM, 512 bytes EEPROM, USART, 4-channel 10 bit ADC, 2-channel 8 bit ADC Pin compatible with Atmega48, ATMega88, ATMega168 Source: avr.lbr; OC_FARNELL: unknown; OC_NEWARK: unknown
U2 = microchip:MCP23017: http://ww1.microchip.com/downloads/en/DeviceDoc/21952a.pdf Source: http://ww1.microchip.com/downloads/en/DeviceDoc/21952a.pdf; MF: MICROCHIP; MPN: MCP23017-E/SP; OC_FARNELL: 1332088; OC_NEWARK: 31K2959
U3-U7 = dec-con:74*38: Quad 2-input NAND gate, open collector output
U8 = 74xx-us:74*10: Triple 3-input NAND gate
U9 = 74xx-us:74*00: Quad 2-input NAND gate
U10 = maxim:MAX232: RS232 TRANSCEIVER; MF: MAXIM; MPN: MAX232ACPE+; OC_FARNELL: 9723773; OC_NEWARK: 68K4544
U11 = microchip:24*: Serial EEPROM I2C; MF: MICROCHIP; MPN: 24LC025-I/P; OC_FARNELL: unknown; OC_NEWARK: 92C7098
U$1 = dec-con:OUTLINE-*: Board outlines for DEC boards.
Y1 = crystal:CRYSTAL: CRYSTAL; OC_FARNELL: 1666973; OC_NEWARK: unknown

## Net classes
0 default: width 0.508 mm
1 supply: width 1.27 mm